# EAGLE design alexakit2 (EAGLE 9.2.2)

## Sheet 1 of 2
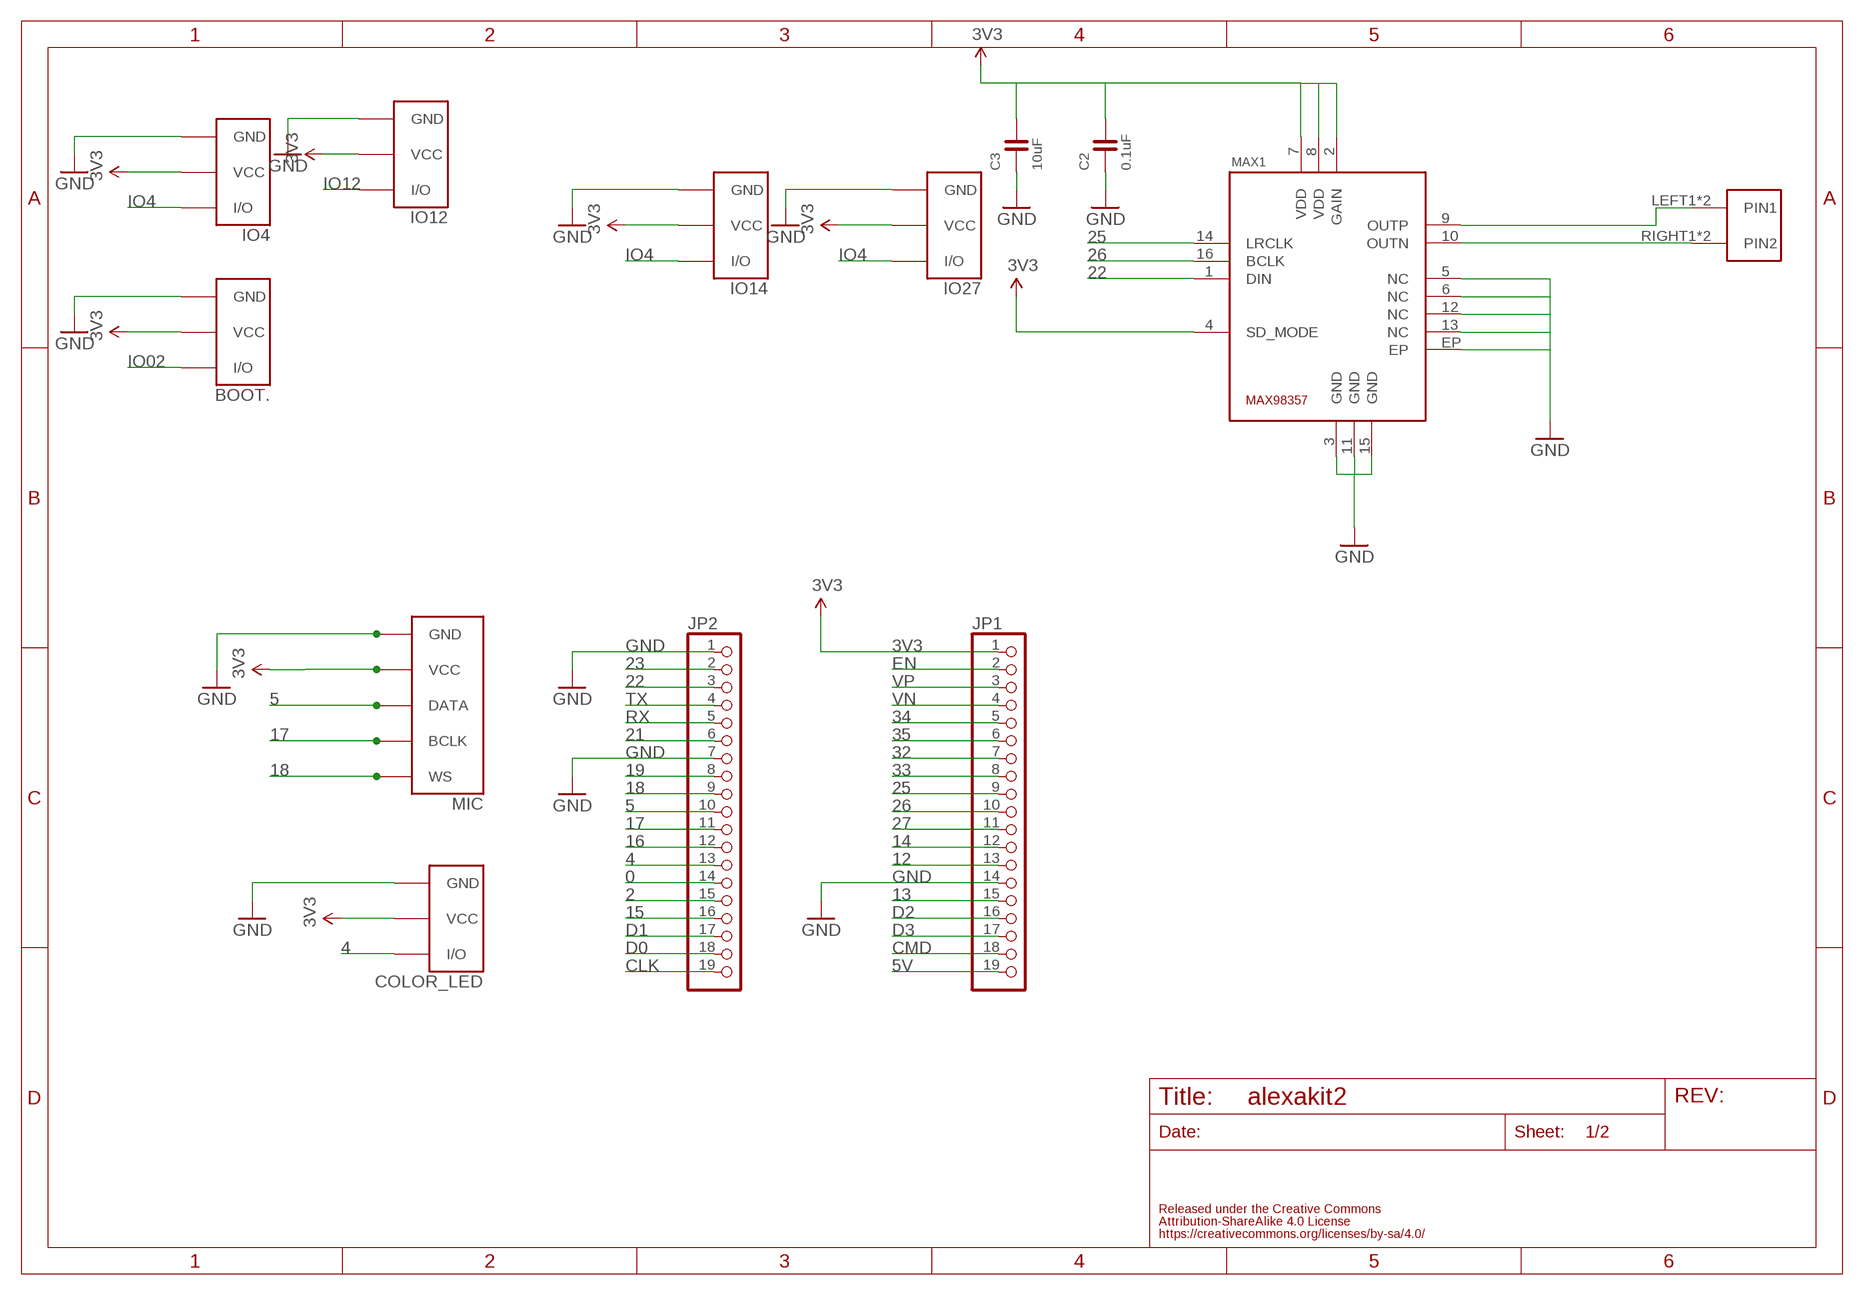
[diagram p0: schematic, sheet 1]

### Parts
BOOT.  BUTTON  FABO_BRICK_3PIN-03B-PASK-1_NAME_BOTTOM  [FABO_BRICK_3PIN_B03B-PASK-1_NAME_BOTTOM]
C2  0.1uF  CAPACITOR-0603  [0603]
C3  10uF  CAPACITOR-0603  [0603]
COLOR_LED  FABO_BRICK_3PIN-03B-PASK-1_NAME_BOTTOM  [FABO_BRICK_3PIN_B03B-PASK-1_NAME_BOTTOM]
IO4  FABO_BRICK_3PIN-03B-PASK-1_NAME_BOTTOM  [FABO_BRICK_3PIN_B03B-PASK-1_NAME_BOTTOM]
IO12  FABO_BRICK_3PIN-03B-PASK-1_NAME_BOTTOM  [FABO_BRICK_3PIN_B03B-PASK-1_NAME_BOTTOM]
IO14  FABO_BRICK_3PIN-03B-PASK-1_NAME_BOTTOM  [FABO_BRICK_3PIN_B03B-PASK-1_NAME_BOTTOM]
IO27  FABO_BRICK_3PIN-03B-PASK-1_NAME_BOTTOM  [FABO_BRICK_3PIN_B03B-PASK-1_NAME_BOTTOM]
JP1  PINHD-1X19  [1X19]
JP2  PINHD-1X19  [1X19]
MAX1  MA-MAX98357  [MAXIM-MAX98357]
MIC  FABO_BRICK_I2STOP  [FABO_BRICK_I2S_B05B-PARK-1]
U$4  ML-1400-S1  [ML-1400-S1]

### Nets
0: JP2.14
2: JP2.15
3V3: BOOT..VCC C2.2 C3.2 COLOR_LED.VCC IO4.VCC IO12.VCC IO14.VCC IO27.VCC JP1.1 MAX1.2(GAIN) MAX1.4(SD_MODE) MAX1.7(VDD) MAX1.8(VDD) MIC.VCC ; also sheet 2
4: COLOR_LED.I/O JP2.13
5: JP2.10 MIC.DATA
5V: JP1.19 ; also sheet 2
12: JP1.13
13: JP1.15
14: JP1.12
15: JP2.16
16: JP2.12
17: JP2.11 MIC.BCLK
18: JP2.9 MIC.WS
19: JP2.8
21: JP2.6
22: JP2.3 MAX1.1(DIN)
23: JP2.2
25: JP1.9 MAX1.14(LRCLK)
26: JP1.10 MAX1.16(BCLK)
27: JP1.11
32: JP1.7
33: JP1.8
34: JP1.5
35: JP1.6
CLK: JP2.19
CMD: JP1.18
D0: JP2.18
D1: JP2.17
D2: JP1.16
D3: JP1.17
EN: JP1.2
GND: BOOT..GND C2.1 C3.1 COLOR_LED.GND IO4.GND IO12.GND IO14.GND IO27.GND JP1.14 JP2.1 JP2.7 MAX1.3(GND) MAX1.5(NC) MAX1.6(NC) MAX1.11(GND) MAX1.12(NC) MAX1.13(NC) MAX1.15(GND) MAX1.EP MIC.GND ; also sheet 2
IO02: BOOT..I/O
IO4: IO4.I/O IO14.I/O IO27.I/O
IO12: IO12.I/O
N$1: MAX1.10(OUTN) U$4.RIGHT1(PIN2) U$4.RIGHT2(PIN2)
N$2: MAX1.9(OUTP) U$4.LEFT1(PIN1) U$4.LEFT2(PIN1)
RX: JP2.5
TX: JP2.4
VN: JP1.4
VP: JP1.3

## Sheet 2 of 2
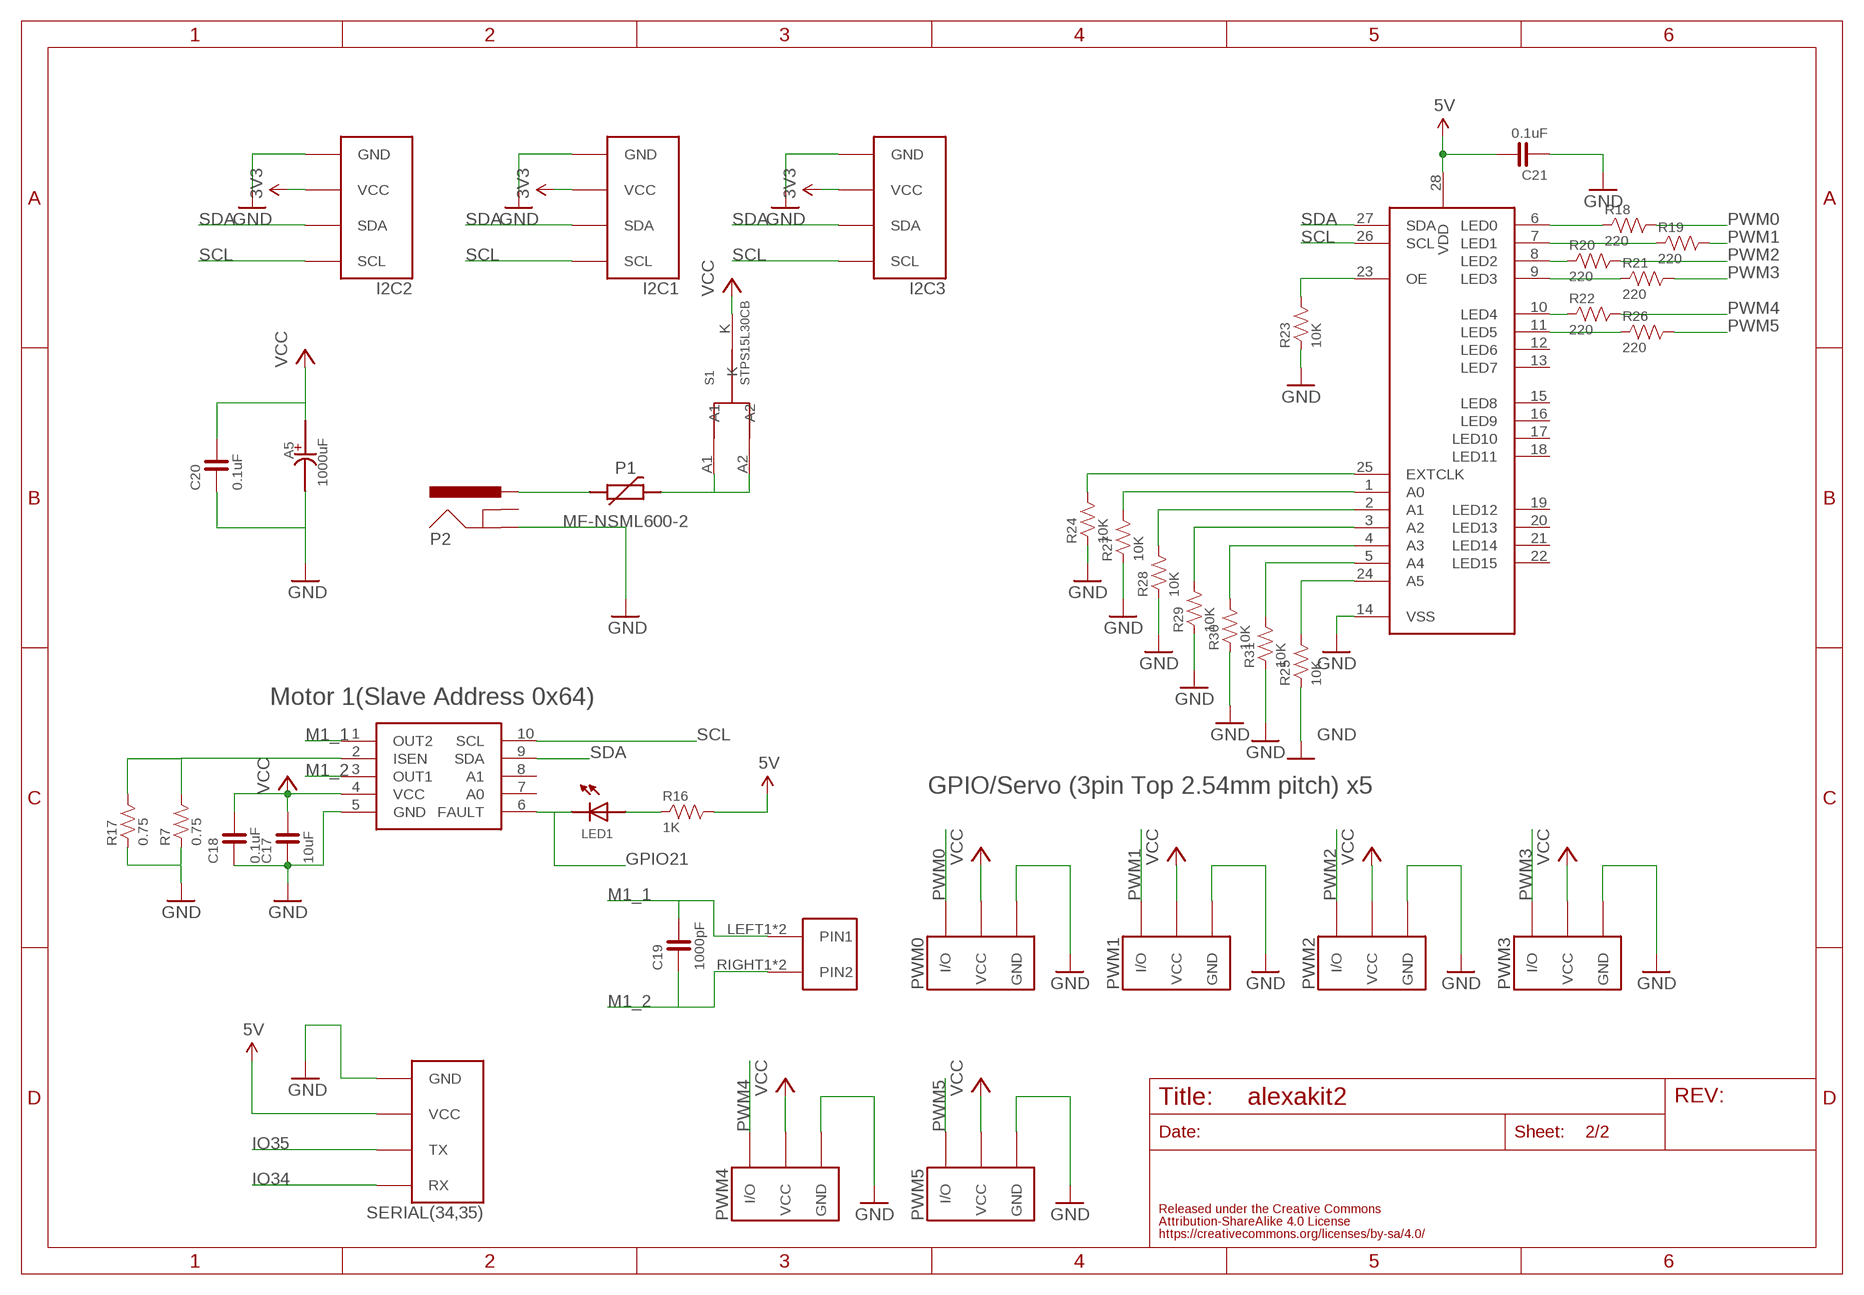
[diagram p1: schematic, sheet 2]

### Parts
A5  1000uF  CAPACITOR-ALUMIN_D12_5  [D12.5]
C17  10uF  CAPACITOR-0603  [0603]
C18  0.1uF  CAPACITOR-0603  [0603]
C19  1000pF  CAPACITOR-0603  [0603]
C20  0.1uF  CAPACITOR-0603  [0603]
C21  0.1uF  CAPACITOR-0603  [0603]
I2C1  FABO_BRICK_I2C-B04B-PASK-1  [FABO_BRICK_I2C_B04B-PASK-1]
I2C2  FABO_BRICK_I2C-B04B-PASK-1  [FABO_BRICK_I2C_B04B-PASK-1]
I2C3  FABO_BRICK_I2C-B04B-PASK-1  [FABO_BRICK_I2C_B04B-PASK-1]
LED1  LED-0603  [0603]
P1  MF-NSML600-2  POLYSWITCH1206  [1206]
P2  DC-JACKM04339A0  [M04339A0]
PWM0  FABO_BRICK_3PIN-HEADER  [FABO_BRICK_3PIN_HEADER]
PWM1  FABO_BRICK_3PIN-HEADER  [FABO_BRICK_3PIN_HEADER]
PWM2  FABO_BRICK_3PIN-HEADER  [FABO_BRICK_3PIN_HEADER]
PWM3  FABO_BRICK_3PIN-HEADER  [FABO_BRICK_3PIN_HEADER]
PWM4  FABO_BRICK_3PIN-HEADER  [FABO_BRICK_3PIN_HEADER]
PWM5  FABO_BRICK_3PIN-HEADER  [FABO_BRICK_3PIN_HEADER]
R7  0.75  RESISTOR-0603  [0603]
R16  1K  RESISTOR-0603  [0603]
R17  0.75  RESISTOR-0603  [0603]
R18  220  RESISTOR-0603  [0603]
R19  220  RESISTOR-0603  [0603]
R20  220  RESISTOR-0603  [0603]
R21  220  RESISTOR-0603  [0603]
R22  220  RESISTOR-0603  [0603]
R23  10K  RESISTOR-0603  [0603]
R24  10K  RESISTOR-0402  [0402]
R25  10K  RESISTOR-0402  [0402]
R26  220  RESISTOR-0603  [0603]
R27  10K  RESISTOR-0603  [0603]
R28  10K  RESISTOR-0603  [0603]
R29  10K  RESISTOR-0603  [0603]
R30  10K  RESISTOR-0603  [0603]
R31  10K  RESISTOR-0603  [0603]
S1  STPS15L30CB  STPS15L30C  [STPS15L30C]
SERIAL(34,35)  FABO_BRICK_SERIAL-B04B-PASK-1  [FABO_BRICK_SERIAL_B04B-PASK-1]
U$8  DRV8830  [DRV8830]
U$9  PCA9685  [PCA9685]
U$12  ML-1400-S1  [ML-1400-S1]

### Nets
3V3: I2C1.VCC I2C2.VCC I2C3.VCC ; also sheet 1
5V: C21.2 R16.2 SERIAL(34,35).VCC U$9.28(VDD) ; also sheet 1
GND: A5.- C17.1 C18.1 C20.1 C21.1 I2C1.GND I2C2.GND I2C3.GND P2.GND PWM0.GND PWM1.GND PWM2.GND PWM3.GND PWM4.GND PWM5.GND R7.1 R17.1 R23.1 R24.P$1 R25.P$1 R27.1 R28.1 R29.1 R30.1 R31.1 SERIAL(34,35).GND U$8.5(GND) U$9.14(VSS) ; also sheet 1
GPIO21: LED1.CATHODE U$8.6(FAULT)
IO34: SERIAL(34,35).RX
IO35: SERIAL(34,35).TX
LED0: R18.1 U$9.6(LED0)
LED1: R19.1 U$9.7(LED1)
LED2: R20.1 U$9.8(LED2)
LED3: R21.1 U$9.9(LED3)
LED4: R22.1 U$9.10(LED4)
LED5: R26.1 U$9.11(LED5)
M1_1: C19.2 U$8.1(OUT2) U$12.LEFT1(PIN1) U$12.LEFT2(PIN1)
M1_2: C19.1 U$8.3(OUT1) U$12.RIGHT1(PIN2) U$12.RIGHT2(PIN2)
N$13: R7.2 R17.2 U$8.2(ISEN)
N$14: LED1.ANODE R16.1
N$15: P1.P$1 P2.VCC(PWR)
N$18: R23.2 U$9.23(OE)
N$19: R24.P$2 U$9.25(EXTCLK)
N$20: R27.2 U$9.1(A0)
N$21: R28.2 U$9.2(A1)
N$22: R29.2 U$9.3(A2)
N$23: R30.2 U$9.4(A3)
N$24: R31.2 U$9.5(A4)
N$25: R25.P$2 U$9.24(A5)
N$28: P1.P$2 S1.A1 S1.A2
PWM0: PWM0.I/O R18.2
PWM1: PWM1.I/O R19.2
PWM2: PWM2.I/O R20.2
PWM3: PWM3.I/O R21.2
PWM4: PWM4.I/O R22.2
PWM5: PWM5.I/O R26.2
SCL: I2C1.SCL I2C2.SCL I2C3.SCL U$8.10(SCL) U$9.26(SCL)
SDA: I2C1.SDA I2C2.SDA I2C3.SDA U$8.9(SDA) U$9.27(SDA)
VCC: A5.+ C17.2 C18.2 C20.2 PWM0.VCC PWM1.VCC PWM2.VCC PWM3.VCC PWM4.VCC PWM5.VCC S1.K U$8.4(VCC)
Unconnected: P2.GNDBREAK U$8.7(A0) U$8.8(A1) U$9.12(LED6) U$9.13(LED7) U$9.15(LED8) U$9.16(LED9) U$9.17(LED10) U$9.18(LED11) U$9.19(LED12) U$9.20(LED13) U$9.21(LED14) U$9.22(LED15)

### Notes on the sheet
- Motor 1(Slave Address 0x64)
- GPIO/Servo (3pin Top 2.54mm pitch) x5

## Library data of the parts
A5 = FaBo-Capacitor:CAPACITOR-ALUMIN
BOOT. COLOR_LED IO4 IO12 IO14 IO27 PWM0 PWM1-PWM5 = FaBo-Template:FABO_BRICK_3PIN: FaBo Brick 3pin
C2 C3 C17-C21 = FaBo-Capacitor:CAPACITOR: CAPACITOR
I2C1-I2C3 = FaBo-Template:FABO_BRICK_I2C: FaBo Brick I2C
JP1 JP2 = pinhead:PINHD-1X19: PIN HEADER
LED1 = FaBo-LED:LED
MAX1 = FaBo-Mems:MA-MAX98357
MIC = FaBo-Template:FABO_BRICK_I2S
P1 = FaBo-Supply:POLYSWITCH
P2 = FaBo-Supply:DC-JACK
R7 R16-R31 = FaBo-Resistors:RESISTOR: RESISTOR
S1 = FaBo-Supply:STPS15L30C
SERIAL(34,35) = FaBo-Template:FABO_BRICK_SERIAL: FaBo Brick Serial
U$4 U$12 = FaBo-Terminal:ML-1400-S1
U$8 = FaBo-Motor:DRV8830
U$9 = FaBo-Motor:PCA9685

## Board
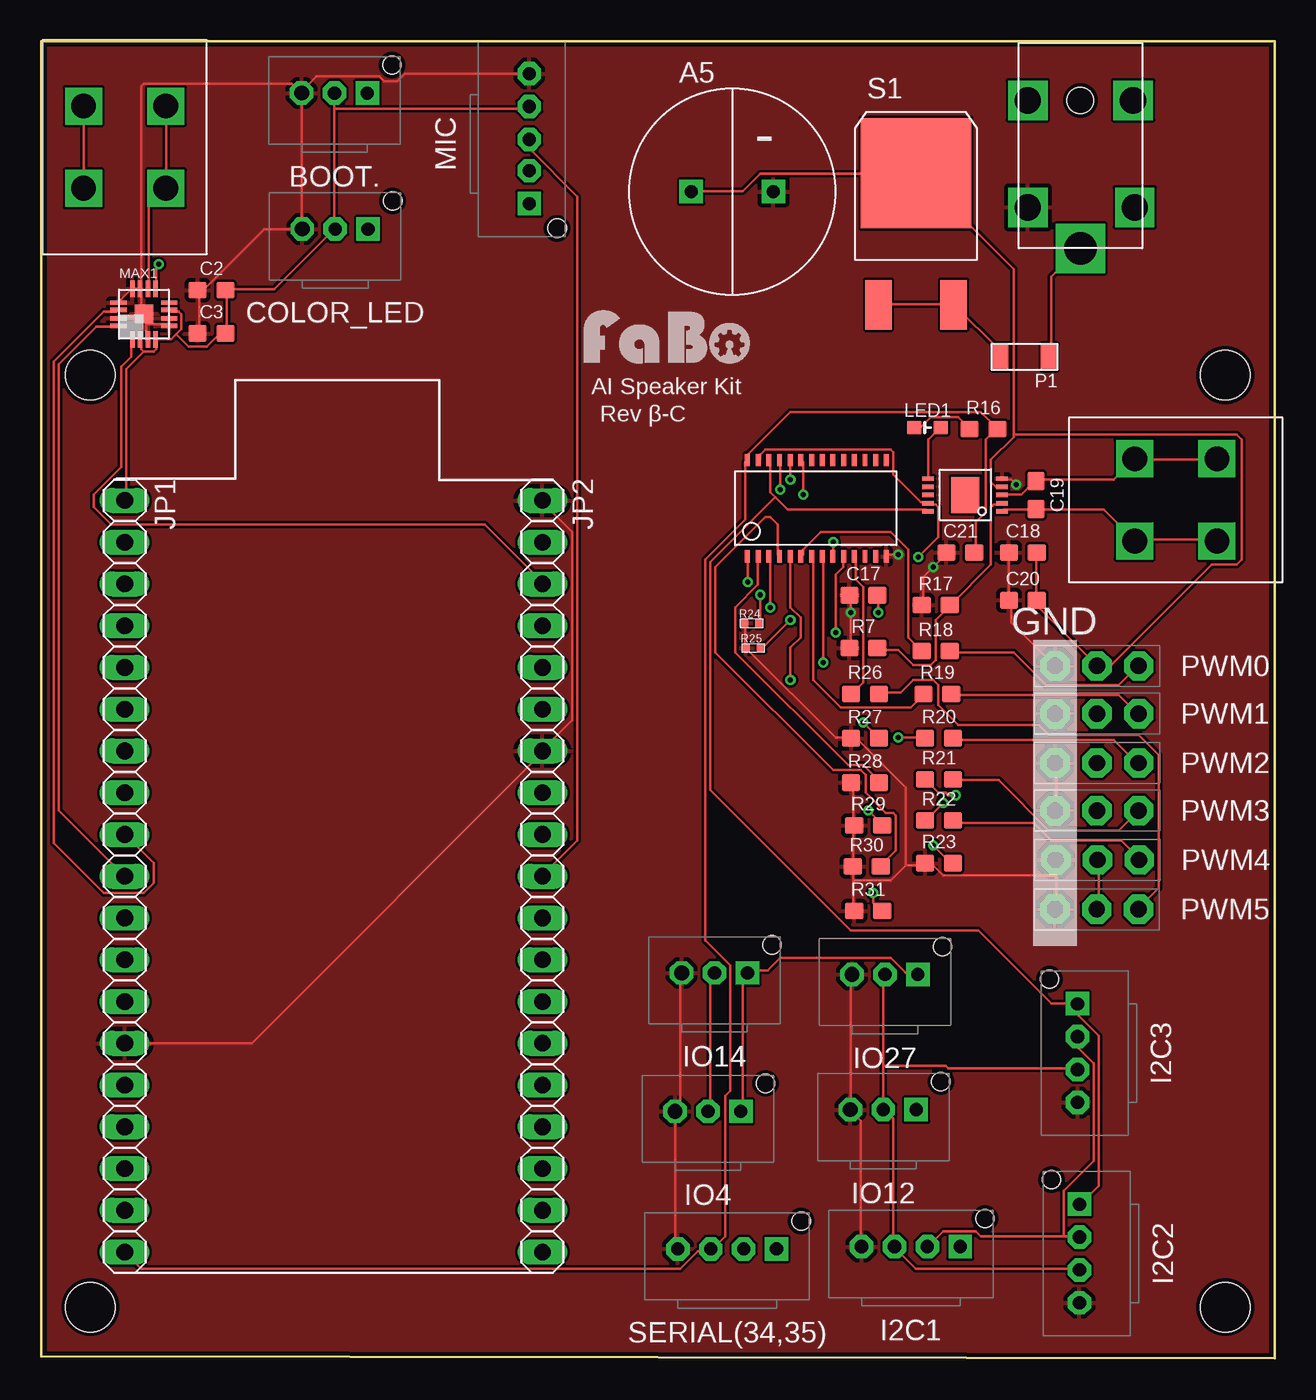
[diagram p2: board, top side]
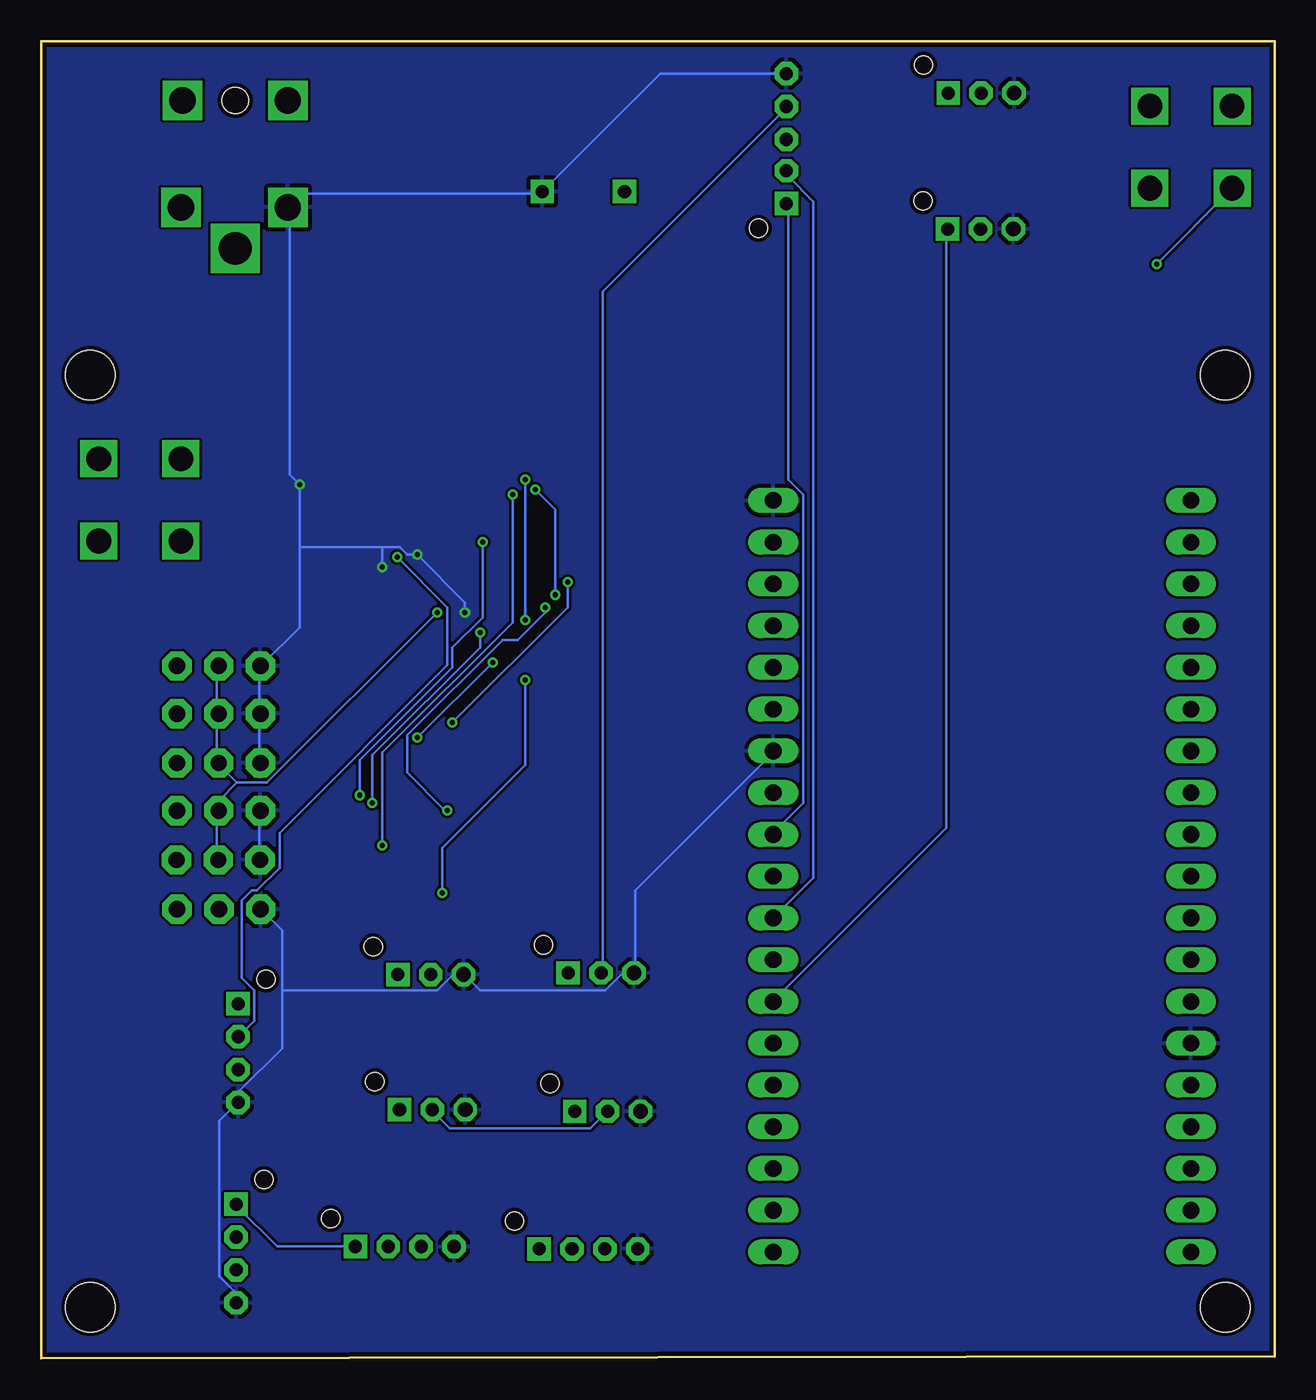
[diagram p3: board, bottom side, seen from below]

Size 75 x 80.13 mm. Coordinates in mm from the lower left corner, seen from the top.
Outline: 0,0.12 75,0 75,80.13 0,80.13 0,0.12
Copper layers (1*16): Top 0.035mm / dielectric 1.5mm / Bottom 0.035mm
Design rules "SeeedStudio_2layer_DRU_no_angle_20140221": minimum track width 6mil, minimum drill 12mil, track to track 6mil, track to pad 6mil, pad to pad 6mil, via to via 6mil, smd to smd 0mil, copper to edge 10mil, drill to drill 10mil, minimum pad ring 10mil, minimum via ring 6mil, stop-mask expansion 2mil, vias tented up to drill 100mil, thermal gap 10mil
Holes 3 mm at 3,59.81 3,3.12 72,3.12 72,59.81

### Footprints (pad centres in the part's own frame; a part is rotated, then mirrored left to right if it is on the bottom)
D12.5 = drill 0.8 pad 1.422 square: + -2.472,0.254; - 2.528,0.254
FABO_BRICK_3PIN_B03B-PASK-1_NAME_BOTTOM = drill 0.9 pad 1.422 octagon: GND -2,0 | drill 0.8 pad 1.422 square: I/O 2,0 | drill 0.8 pad 1.422 octagon: VCC 0,0 | hole 1.1: 3.5,1.7
0603 = smd 1.1 x 1: 1 -0.85,0; 2 0.85,0
FABO_BRICK_I2C_B04B-PASK-1 = drill 0.8 pad 1.422 octagon: GND -3,0; SDA 1,0; VCC -1,0 | drill 0.8 pad 1.422 square: SCL 3,0 | hole 1.1: 4.5,1.7
1X19 = drill 1.016 long: 1 -22.86,0; 2 -20.32,0; 3 -17.78,0; 4 -15.24,0; 5 -12.7,0; 6 -10.16,0; 7 -7.62,0; 8 -5.08,0; 9 -2.54,0; 10 0,0; 11 2.54,0; 12 5.08,0; 13 7.62,0; 14 10.16,0; 15 12.7,0; 16 15.24,0; 17 17.78,0; 18 20.32,0; 19 22.86,0
0603' = smd 0.9 x 0.8: ANODE -0.8,0; CATHODE 0.8,0
MAXIM-MAX98357 = smd 0.27 x 1: 1 -0.7,-1.54; 2 -0.25,-1.54; 3 0.25,-1.54; 4 0.7,-1.54; 9 0.7,1.54; 10 0.25,1.54; 11 -0.25,1.54; 12 -0.7,1.54 | smd 1 x 0.27: 5 1.54,-0.7; 6 1.54,-0.25; 7 1.54,0.25; 8 1.54,0.7; 13 -1.54,0.7; 14 -1.54,0.25; 15 -1.54,-0.25; 16 -1.54,-0.7 | smd 1.143 x 1.143: EP 0.005,0.02
FABO_BRICK_I2S_B05B-PARK-1 = drill 0.8 pad 1.422 octagon: BCLK 1.635,2.54; DATA -0.27,2.54; GND -4.27,2.54; VCC -2.27,2.54 | drill 0.8 pad 1.422 square: WS 3.635,2.54 | hole 1.1: 5.135,4.24
1206 = smd 1 x 1.6: P$1 -1.5,0; P$2 1.5,0
M04339A0 = drill 1.6 square: GND -3.2,-6.5; GNDBREAK 3.3,-6.5; ND1 -3.2,0; ND2 3.2,0 | drill 2 square: VCC 0,-9 | hole 1.6: 0,0
FABO_BRICK_3PIN_HEADER = drill 1 pad 1.778 octagon: GND -2.54,0; I/O 2.54,0; VCC 0,0
0402 = smd 0.5 x 0.5: P$1 -0.46,0; P$2 0.46,0
STPS15L30C = smd 1.6 x 3: A1 -2.286,-6.13; A2 2.286,-6.13 | smd 6.7 x 6.7: K 0,1.87
FABO_BRICK_SERIAL_B04B-PASK-1 = drill 0.8 pad 1.422 octagon: GND -3,0; TX 1,0; VCC -1,0 | drill 0.8 pad 1.422 square: RX 3,0 | hole 1.1: 4.5,1.7
ML-1400-S1 = drill 1.5 square: LEFT1 -2.5,2.5; LEFT2 -2.5,-2.5; RIGHT1 2.5,2.5; RIGHT2 2.5,-2.5
DRV8830 = smd 0.27 x 0.7: 1 -1,-2.24; 2 -0.5,-2.24; 3 0,-2.24; 4 0.5,-2.24; 5 1,-2.24; 6 1,2.26; 7 0.5,2.26; 8 0,2.26; 9 -0.5,2.26; 10 -1,2.26 | smd 2.18 x 1.72: P$1 0,0
PCA9685 = smd 0.3 x 0.75: 1 -4.15,-2.93; 2 -3.5,-2.93; 3 -2.85,-2.93; 4 -2.2,-2.93; 5 -1.55,-2.93; 6 -0.9,-2.93; 7 -0.25,-2.93; 8 0.4,-2.93; 9 1.05,-2.93; 10 1.7,-2.93; 11 2.35,-2.93; 12 3,-2.93; 13 3.65,-2.93; 14 4.3,-2.93; 15 4.3,2.92; 16 3.65,2.92; 17 3,2.92; 18 2.35,2.92; 19 1.7,2.92; 20 1.05,2.92; 21 0.4,2.92; 22 -0.25,2.92; 23 -0.9,2.92; 24 -1.55,2.92; 25 -2.2,2.92; 26 -2.85,2.92; 27 -3.5,2.92; 28 -4.15,2.92

### Placement (x,y rotation side)
A5  42,70.72 0 top
BOOT.  17.84,76.97 0 top
C2  10.36,64.99 0 top
C3  10.36,62.35 0 top
C17  50,46.42 0 top
C18  59.7,49.02 0 top
C19  60.5,52.52 270 top
C20  59.7,46.12 0 top
C21  55.9,49.02 0 top
COLOR_LED  17.88,68.7 0 top
I2C1  52.89,6.8 0 top
I2C2  63.14,6.38 90 top
I2C3  63.02,18.57 90 top
IO4  40.55,15.03 0 top
IO12  51.21,15.13 0 top
IO14  40.95,23.45 0 top
IO27  51.31,23.35 0 top
JP1  5.08,29.33 270 top
JP2  30.48,29.33 270 top
LED1  [0603']  53.9,56.62 0 top
MAX1  6.25,63.52 0 top
MIC  27.14,73.88 270 top
P1  59.8,60.92 180 top
P2  63.2,76.52 0 top
PWM0  64.2,42.12 0 top
PWM1  64.2,39.22 0 top
PWM2  64.2,36.22 0 top
PWM3  64.2,33.32 0 top
PWM4  64.23,30.32 0 top
PWM5  64.19,27.32 0 top
R7  50,43.22 0 top
R16  57.3,56.52 0 top
R17  54.4,45.82 0 top
R18  54.4,43.02 0 top
R19  54.5,40.42 0 top
R20  54.6,37.72 0 top
R21  54.6,35.22 0 top
R22  54.6,32.72 0 top
R23  54.6,30.12 0 top
R24  43.2,44.72 0 top
R25  43.3,43.22 0 top
R26  50.1,40.42 0 top
R27  50.1,37.72 0 top
R28  50.1,35.02 0 top
R29  50.3,32.42 0 top
R30  50.2,29.92 0 top
R31  50.3,27.22 0 top
S1  53.2,70.22 0 top
SERIAL(34,35)  41.72,6.66 0 top
U$2  [LOGO_FABO_MS]  38.05,60.14 0 top
U$4  5.08,73.68 0 top
U$8  56.2,52.52 90 top
U$9  47.1,51.72 0 top
U$12  69,52.22 90 top

### Tracks (layer width: path | path; a pad name or v marks a point on that pad's centre or on a via)
3V3
  Top 0.152: IO4.VCC 40.69,15.05 40.69,23.29 40.84,23.44 IO14.VCC | 51.21,17.8 51.21,23.29 IO27.VCC | 51.21,17.8 51.21,15.21 IO12.VCC 51.36,15.05 51.82,14.6 51.82,6.83 I2C1.VCC 51.97,6.67 53.19,5.45 63.09,5.45 I2C2.VCC | 51.21,17.8 55.02,17.8 55.17,17.65 62.94,17.65 I2C3.VCC | MAX1.8 7.77,64.13 7.77,63.82 MAX1.7 7.92,63.67 8.38,63.67 8.53,63.52 8.53,62.6 8.23,62.3 | 6.25,61.23 6.1,61.38 6.1,61.84 MAX1.2 | 6.25,61.23 6.86,61.23 7.01,61.38 7.01,61.84 MAX1.4 7.01,61.99 7.92,61.99 8.23,62.3 | 8.23,62.3 8.99,61.54 10.06,61.54 10.82,62.3 11.12,62.3 C3.2 11.28,62.45 11.28,64.89 C2.2 11.28,65.04 14.17,65.04 17.83,68.7 | 6.25,61.23 5.18,60.17 5.18,52.24 JP1.1 | 17.83,68.7 17.83,76.02 | 17.83,76.02 17.83,76.93 BOOT..VCC | 17.83,76.02 29.57,76.02 MIC.VCC | 17.83,68.7 COLOR_LED.VCC
  Bottom 0.152: IO4.VCC 40.69,14.9 41.6,13.99 50.14,13.99 51.21,15.05 IO12.VCC | IO14.VCC 40.84,23.59 40.84,64.89 29.72,76.02 MIC.VCC
4
  Bottom 0.152: COLOR_LED.I/O 19.96,68.7 19.96,32.28 30.48,21.76 JP2.13
5
  Top 0.152: MIC.DATA 29.72,74.03 29.72,73.58 32.61,70.68 32.61,31.51 30.48,29.38 JP2.10
5V
  Top 0.152: C21.2 56.84,49.04 56.84,50.87 57.45,51.48 57.45,55.9 58.06,56.51 R16.2 58.06,56.66 57.15,57.57 45.57,57.57 42.98,54.98 42.98,54.68 U$9.28 42.82,54.53 42.82,51.02 40.39,48.58 40.39,25.42 41.91,23.89 41.91,16.27 41.6,15.97 41.6,7.44 40.84,6.67 SERIAL(34,35).VCC 40.69,6.52 39.93,6.52 38.86,5.45 6.1,5.45 JP1.19
17
  Bottom 0.152: JP2.11 28.04,29.23 28.04,70.38 29.57,71.9 29.57,72.2 MIC.BCLK
18
  Bottom 0.152: MIC.WS 29.57,70.22 29.57,53.46 28.65,52.55 28.65,33.8 30.48,31.97 JP2.9
22
  Top 0.152: MAX1.1 5.49,61.84 5.49,60.93 4.88,60.32 4.88,54.22 3.2,52.55 3.2,51.78 4.27,50.72 26.98,50.72 30.48,47.21 JP2.3
25
  Top 0.152: MAX1.14 4.57,63.67 3.81,63.67 0.76,60.62 0.76,31.36 3.81,28.31 6.25,28.31 6.86,28.92 6.86,30.14 5.18,31.82 JP1.9
26
  Top 0.152: JP1.10 1.07,33.34 1.07,60.47 3.35,62.76 4.57,62.76 MAX1.16
GND  (via drill 0.3)
  Top 0.152: MAX1.13 4.72,64.28 5.49,65.04 MAX1.12 5.64,65.04 5.94,65.04 MAX1.11 | 7.77,62.91 7.77,63.21 MAX1.6 | MAX1.15 4.72,63.37 6.1,63.37 6.25,63.52 MAX1.EP | 6.4,62.91 6.4,63.52 MAX1.EP | 6.4,62.91 6.4,61.99 MAX1.3 | 6.4,62.91 7.77,62.91 | 7.77,62.91 MAX1.5 | MAX1.11 6.1,65.04 6.1,63.82 6.25,63.67 MAX1.EP | C3.1 9.6,62.45 9.6,64.89 C2.1 9.6,65.04 9.91,65.04 13.56,68.7 15.85,68.7 | 15.85,68.7 15.85,76.93 BOOT..GND | 15.85,68.7 COLOR_LED.GND | MIC.GND 29.57,78.15 22.1,78.15 21.64,77.69 20.88,77.69 20.57,78 16.76,78 15.85,77.08 BOOT..GND | MAX1.11 6.1,65.2 6.1,77.39 6.25,77.54 15.24,77.54 15.7,77.08 BOOT..GND | R17.1 53.65,45.84 53.65,47.52 v54.25,48.13 55.02,48.89 C21.1 | R7.1 49.23,43.25 v49.23,45.38 49.23,46.3 C17.1 | C18.1 58.83,48.89 58.83,46.14 C20.1 58.98,45.99 58.98,44.77 61.57,42.18 PWM0.GND | v59.28,53.15 58.98,53.46 58.52,53.46 U$8.5 | v52.12,48.89 51.51,48.89 U$9.14 | JP1.14 12.8,19.17 30.48,36.85 JP2.7 30.48,37 32.31,38.83 32.31,50.26 30.48,52.09 JP2.1 | SERIAL(34,35).GND 38.71,6.67 38.56,6.83 38.56,14.9 IO4.GND 38.56,15.05 38.86,15.36 38.86,23.44 IO14.GND | IO27.GND 49.23,23.29 49.23,15.21 IO12.GND 49.23,15.05 49.84,14.45 49.84,6.83 I2C1.GND | R24.P$1 42.82,44.62 42.82,43.25 R25.P$1 42.98,43.1 48.31,37.76 49.23,37.76 R27.1 49.38,37.61 49.68,37.61 52.58,34.71 52.58,29.99 | R28.1 49.38,35.02 49.38,32.43 R29.1 49.38,32.28 49.38,29.99 R30.1 49.38,29.84 49.38,29.08 | 49.38,29.08 49.38,27.25 R31.1 | 52.58,29.99 53.65,29.99 R23.1 53.8,29.99 54.25,29.99 54.86,29.38 61.72,29.38 | 52.58,29.99 51.66,29.08 49.38,29.08 | PWM3.GND 61.72,33.34 61.72,36.09 PWM2.GND
  Top 0.152: 61.72,29.38 61.72,30.3 PWM4.GND | 61.72,29.38 61.72,27.4 PWM5.GND
  Bottom 0.152: 59.28,49.34 59.28,44.47 61.57,42.18 PWM0.GND 61.72,42.03 61.72,39.29 PWM1.GND 61.72,39.13 61.72,36.24 PWM2.GND | 59.28,49.34 v59.28,53.15 59.89,53.77 59.89,69.92 P2.GND 59.89,70.07 59.13,70.83 44.65,70.83 A5.- 44.5,70.99 37.34,78.15 29.72,78.15 MIC.GND | 59.28,49.34 54.25,49.34 | 54.25,49.34 53.19,49.34 52.73,48.89 v52.12,48.89 49.23,45.99 v49.23,45.38 | 54.25,49.34 v54.25,48.13 | I2C2.GND 63.25,3.47 63.25,4.08 64.16,5 64.16,14.45 63.09,15.51 I2C3.GND 62.94,15.66 62.94,16.27 60.35,18.87 60.35,22.37 | PWM3.GND 61.72,33.19 61.72,30.45 PWM4.GND | 60.35,22.37 60.35,26.03 61.57,27.25 PWM5.GND | 60.35,22.37 50.9,22.37 49.99,23.29 49.38,23.29 IO27.GND 49.23,23.29 48.31,22.37 40.69,22.37 39.62,23.44 39.01,23.44 IO14.GND 38.86,23.59 38.86,28.47 30.48,36.85 JP2.7
  pour Top: 0,0.12 74.93,0.12 74.93,80.13 0,80.13
  pour Bottom: 0,0.12 74.93,0.12 74.93,80.13 0,80.13 0,1.39
GPIO21
  Top 0.152: U$8.6 53.95,53.61 53.95,55.9 54.56,56.51 LED1.CATHODE
IO4
  Top 0.152: IO4.I/O 42.67,15.05 42.67,23.29 42.82,23.44 IO14.I/O 42.98,23.59 44.2,23.59 44.96,24.35 51.66,24.35 52.58,23.44 53.19,23.44 IO27.I/O
LED0
  Top 0.152: U$9.6 46.33,48.89 46.33,49.19 47.4,50.26 51.66,50.26 52.73,49.19 52.73,43.86 53.49,43.1 R18.1
LED1
  Top 0.152: U$9.7 46.94,48.74 46.94,41.27 48.62,39.59 52.88,39.59 53.65,40.35 R19.1
LED2  (via drill 0.3)
  Top 0.152: v47.55,42.34 47.55,48.74 U$9.8 | v52.12,37.76 53.65,37.76 R20.1
  Bottom 0.152: v52.12,37.76 v47.55,42.34
LED3  (via drill 0.3)
  Top 0.152: v48.16,49.65 48.16,48.89 U$9.9 | v55.63,34.26 55.17,34.26 55.02,34.41 54.56,34.41 53.8,35.17 R21.1
  Bottom 0.152: v48.16,49.65 48.16,45.08 49.99,43.25 49.99,42.03 55.63,36.39 v55.63,34.26
LED4  (via drill 0.3)
  Top 0.152: v48.31,44.16 48.31,47.67 48.77,48.13 48.77,48.74 U$9.10 | v54.86,33.8 53.8,32.73 R22.1
  Bottom 0.152: v48.31,44.16 48.31,43.25 54.86,36.7 v54.86,33.8
LED5
  Top 0.152: U$9.11 49.53,48.74 49.53,47.36 49.99,46.91 49.99,41.12 49.38,40.51 R26.1
M1_1
  Top 0.152: U$8.1 58.52,51.63 60.35,51.63 C19.2 60.5,51.63 64.62,51.63 66.45,49.8 U$12.LEFT1 66.6,49.8 71.48,49.8 U$12.LEFT2
M1_2
  Top 0.152: U$8.3 58.52,52.55 59.59,52.55 60.35,53.31 C19.1 60.5,53.46 65.23,53.46 66.45,54.68 U$12.RIGHT1 66.6,54.68 71.48,54.68 U$12.RIGHT2
N$1
  Top 0.152: MAX1.10 6.55,65.2 6.55,70.22 7.47,71.14 U$4.RIGHT2 7.62,71.29 7.62,76.17 U$4.RIGHT1
N$2  (via drill 0.3)
  Top 0.152: v7.16,66.57 7.01,66.41 7.01,65.2 MAX1.9 | U$4.LEFT1 2.59,76.17 2.59,71.29 U$4.LEFT2
  Bottom 0.152: v7.16,66.57 2.59,71.14 U$4.LEFT2
N$13
  Top 0.152: U$8.2 58.37,51.94 57.91,51.94 57.76,51.78 57.76,48.28 55.32,45.84 R17.2 55.17,45.69 54.41,44.93 54.41,42.49 54.1,42.18 53.03,42.18 52.12,43.1 50.9,43.1 R7.2
N$14
  Top 0.152: LED1.ANODE 53.19,56.66 53.49,56.66 54.1,57.27 55.78,57.27 56.39,56.66 R16.1
N$15
  Top 0.152: P1.P$1 61.42,60.93 61.42,65.8 63.09,67.48 P2.VCC
N$18  (via drill 0.3)
  Top 0.152: v46.33,52.55 46.33,54.53 U$9.23 | v54.25,31.21 55.32,30.14 R23.2
  Bottom 0.152: v46.33,52.55 46.33,44.77 54.25,36.85 v54.25,31.21
N$19  (via drill 0.3)
  Top 0.152: v43.74,46.45 43.74,44.77 R24.P$2 | v44.96,52.85 44.96,54.53 U$9.25
  Bottom 0.152: v43.74,46.45 43.74,51.63 v44.96,52.85
N$20  (via drill 0.3)
  Top 0.152: v42.98,47.21 42.98,48.74 U$9.1 | v49.99,38.68 50.9,37.76 R27.2
  Bottom 0.152: v42.98,47.21 42.98,45.69 v49.99,38.68
N$21
  Top 0.152: U$9.2 43.59,48.74 43.59,47.06 42.22,45.69 42.22,42.94 49.07,36.09 49.99,36.09 50.9,35.17 R28.2
N$22  (via drill 0.3)
  Top 0.152: v44.35,45.69 44.35,48.74 U$9.3 | v50.29,33.34 51.21,32.43 R29.2
  Bottom 0.152: v44.35,45.69 44.35,45.38 46.02,43.71 46.94,43.71 52.73,37.91 52.73,35.63 50.44,33.34 v50.29,33.34
N$23
  Top 0.152: U$9.4 44.81,48.89 44.81,50.72 44.35,51.17 44.04,51.17 41,48.13 41,42.94 48.16,35.78 49.84,35.78 50.14,35.48 50.14,34.41 51.36,33.19 51.82,33.19 51.97,33.04 51.97,30.91 51.05,29.99 R30.2
N$24  (via drill 0.3)
  Top 0.152: v45.57,41.27 45.57,43.25 46.18,43.86 46.18,45.08 45.57,45.69 45.57,48.74 U$9.5 | v50.6,28.31 50.6,27.7 51.05,27.25 R31.2
  Bottom 0.152: v45.57,41.27 45.57,36.09 50.6,31.06 v50.6,28.31
N$25  (via drill 0.3)
  Top 0.152: v45.57,44.93 43.89,43.25 R25.P$2 | v45.57,53.46 45.57,54.53 U$9.24
  Bottom 0.152: v45.57,53.46 v45.57,44.93
N$28
  Top 0.152: P1.P$2 58.22,60.93 58.22,61.38 55.63,63.98 S1.A2 55.47,64.13 51.05,64.13 S1.A1
PWM0
  Top 0.152: R18.2 55.32,42.94 59.13,42.94 61.11,40.96 65.53,40.96 66.6,42.03 PWM0.I/O
PWM1
  Top 0.152: R19.2 55.47,40.35 65.53,40.35 66.6,39.29 PWM1.I/O
PWM2
  Top 0.152: R20.2 55.47,37.61 65.23,37.61 66.6,36.24 PWM2.I/O
PWM3
  Top 0.152: R21.2 55.47,35.17 58.22,35.17 61.27,32.12 65.53,32.12 66.6,33.19 PWM3.I/O
PWM4
  Top 0.152: R22.2 55.47,32.58 60.35,32.58 61.42,31.51 65.68,31.51 66.75,30.45 PWM4.I/O
PWM5
  Top 0.152: R26.2 51.05,40.51 52.27,40.51 53.03,41.27 54.25,41.27 54.56,40.96 54.56,39.74 55.78,38.52 60.66,38.52 61.27,37.91 66.75,37.91 67.97,36.7 67.97,28.62 66.75,27.4 PWM5.I/O
SCL
  Top 0.152: 44.65,52.39 44.35,52.7 44.35,54.53 U$9.26 | 44.65,52.39 45.41,51.63 53.8,51.63 U$8.10 | I2C2.SCL 63.25,9.42 64.31,10.48 64.31,19.63 63.09,20.85 63.09,21.46 I2C3.SCL 62.94,21.61 61.42,21.61 57,26.03 49.23,26.03 40.69,34.56 40.69,48.43 44.65,52.39
  Bottom 0.152: I2C1.SCL 55.93,6.83 60.66,6.83 63.09,9.26 I2C2.SCL
SDA  (via drill 0.3)
  Top 0.152: U$9.27 43.74,54.68 43.74,54.98 44.04,55.29 51.66,55.29 51.82,55.14 51.82,53.77 53.49,52.09 53.8,52.09 U$8.9 53.95,51.94 54.41,51.94 54.56,51.78 54.56,49.95 v53.34,48.74 | 62.18,7.44 63.09,7.44 I2C2.SDA | 62.18,7.44 57.15,7.44 56.84,7.74 54.86,7.74 53.95,6.83 I2C1.SDA | 62.18,7.44 62.18,10.18 64.01,12.01 64.01,17.95 63.09,18.87 63.09,19.48 I2C3.SDA
  Bottom 0.152: v53.34,48.74 50.29,45.69 50.29,42.18 60.5,31.97 60.5,29.84 61.87,28.47 62.18,28.47 62.79,27.86 62.79,23.13 62.03,22.37 62.03,20.54 62.94,19.63 I2C3.SDA
VCC  (via drill 0.3)
  Top 0.152: C18.2 60.5,48.89 60.5,46.14 C20.2 60.66,45.99 60.66,45.69 64.16,42.18 PWM0.VCC 64.31,42.18 65.08,42.18 71.17,48.28 72.69,48.28 73,48.58 73,55.9 72.69,56.2 59.13,56.2 | PWM5.VCC 64.31,27.4 64.31,30.3 PWM4.VCC | v50.9,45.38 50.9,46.3 C17.2 | 59.13,56.2 59.13,66.26 53.34,72.05 S1.K 53.19,72.05 43.74,72.05 42.67,70.99 39.62,70.99 A5.+ | 59.13,56.2 59.13,56.05 57.76,54.68 57.76,53.31 58.06,53 58.37,53 U$8.4
  Bottom 0.152: PWM0.VCC 64.31,42.03 64.31,39.29 PWM1.VCC 64.31,39.13 64.31,36.24 PWM2.VCC 64.16,36.09 63.09,35.02 | v50.9,45.38 61.27,35.02 63.09,35.02 | 63.09,35.02 64.16,33.95 64.16,33.34 PWM3.VCC 64.31,33.19 64.31,30.45 PWM4.VCC

### Text on the board
tPlace: AI Speaker Kit | Rev β-C | GND